# Altium schematic sheet Battery.SchDoc
size A4; SheetNumber: 2; SheetTotal: 2; SPICEModelCacheDQVFCDDG: <root> / <DocumentId>DQVFCDDG</DocumentId> / <CacheFrame Number="0"> / <Model Name="cap" Kind="MDL"> / <Text>*Default semiconductor capacitor / .MODEL CAP C()</Text> / </Model> / </CacheFrame> / </root>
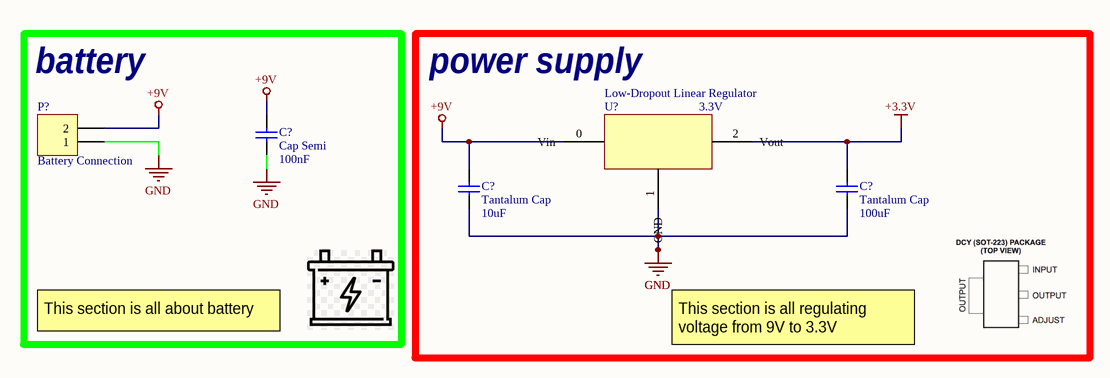
[diagram p0: Battery.SchDoc]

## Parts
(Parts that share a designator on the sheet are numbered #1, #2 ... from top to bottom, then left to right.)
C?#1  Cap Semi  value 100nF  [C1206]
C?#2  Tantalum Cap  value 10uF  [C1206]
C?#3  Tantalum Cap  value 100uF  [C1206]
P?  Battery Connection  [HDR1X2H]
U?  Low-Dropout Linear Regulator  Output Voltage: 3.3V

## Blocks framed on the sheet
battery: C?#1 P?
power supply: C?#2 C?#3 U?

## Nets
+3.3V: C?#3.2
+9V: C?#1.2 C?#2.2 P?.2
GND: C?#1.1 C?#2.1 C?#3.1 P?.1

Not connected (* = marked no-connect by the designer): U? 0(Vin) 1(GND) 2(Vout)

## Notes on the sheet
- This section is all about battery
- This section is all regulating voltage from 9V to 3.3V

## Library data of the parts
C?#1-C?#3 = Cap Semi: Capacitor (Semiconductor SIM Model); Published: 8-Jun-2000; LatestRevisionDate: 29-May-2009; LatestRevisionNote: IPC-7351 Footprint Added.; PackageReference: C1206; Publisher: Altium Limited; PackageDescription: Chip Capacitor
P? = Header 2H: Header, 2-Pin, Right Angle; LatestRevisionDate: 17-Jul-2002; LatestRevisionNote: Re-released for DXP Platform.; Publisher: Altium Limited
U? = lm1117: The LM1117 is a low dropout voltage regulator with a / dropout of 1.2 V at 800 mA of load current. / The LM1117 is available in an adjustable version, / which can set the output voltage from 1.25 V to 13.8 V / with only two external resistors. In addition, the device / is available in five fixed voltages, 1.8 V, 2.5 V, 3.3 V, / and 5 V. / The LM1117 offers current limiting and thermal / shutdown. The circuit includes a Zener trimmed bandgap reference to assure output voltage accuracy to / within ±1%. / A minimum of 10-µF tantalum capacitor is required / at the output to improve the transient response and / stability.; ComponentLink1Description: datasheet; ComponentLink1URL: https://www.ti.com/lit/ds/symlink/lm1117.pdf?ts=1712049006696&ref_url=https%253A%252F%252Fwww.ti.com%252Fproduct%252FLM1117%253Futm_source%253Dgoogle%2526utm_medium%253Dcpc%2526utm_campaign%253Dapp-lp-null-44700045336317554_prodfolderdynamic-cpc-pf-google-eu_int%2526utm_content%253Dprodfolddynamic%2526ds_k%253DDYNAMIC+SEARCH+ADS%2526DCM%253Dyes%2526gad_source%253D1%2526gclid%253DCj0KCQjw2a6wBhCVARIsABPeH1uYEq1Svy05QXeal8vxv4gDdpf7Kfib-JbV4jIHqkrYcvgrk_cPtXsaAl5sEALw_wcB%2526gclsrc%253Daw.ds